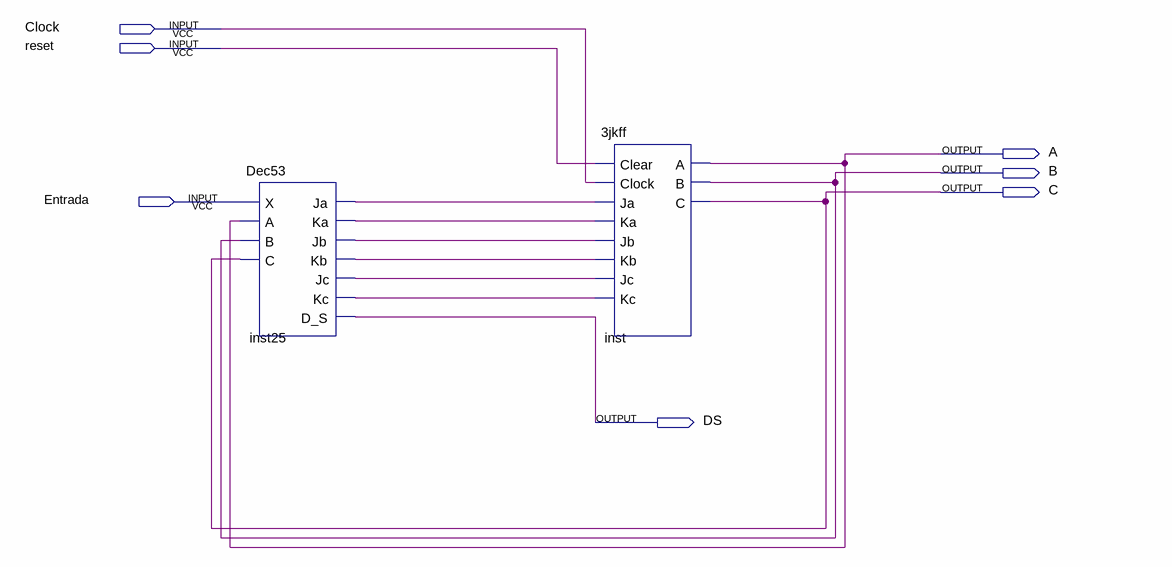
[diagram p0: schematic sheet]
// Quartus schematic Lab6.bdf as structural Verilog: 2 symbols, 7 pins
module Lab6 (
  input  Clock,
  input  reset,
  input  Entrada,
  output A,
  output B,
  output C,
  output DS
);

  wire inst25_ja, inst25_jb, inst25_jc, inst25_ka, inst25_kb, inst25_kc;

  Dec53 inst25 (
    .X(Entrada), .A(A), .B(B), .C(C), .Ja(inst25_ja), .Ka(inst25_ka), .Jb(inst25_jb), .Kb(inst25_kb),
    .Jc(inst25_jc), .Kc(inst25_kc), .D_S(DS));
  \3jkff  inst (
    .Clear(reset), .Clock(Clock), .Ja(inst25_ja), .Ka(inst25_ka), .Jb(inst25_jb), .Kb(inst25_kb),
    .Jc(inst25_jc), .Kc(inst25_kc), .A(A), .B(B), .C(C));
endmodule
